# Altium schematic sheet control_system.SchDoc: Control System
size A4; Author: AJ; DrawnBy: AJ; Engineer: AJ; DocumentNumber: 1; Revision: 001; SheetNumber: 1; SheetTotal: 6; Description: Document Map
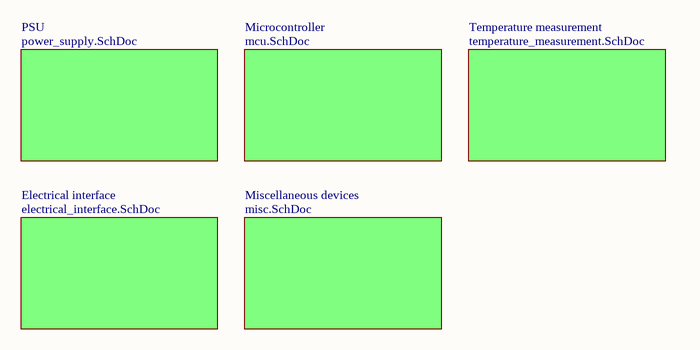
[diagram p0: control_system.SchDoc]

## Sub-sheets
Electrical interface = electrical_interface.SchDoc: no entries
Microcontroller = mcu.SchDoc: no entries
Miscellaneous devices = misc.SchDoc: no entries
PSU = power_supply.SchDoc: no entries
Temperature measurement = temperature_measurement.SchDoc: no entries

## Notes on the sheet
- TITLE
- DESCRIPTION
- SHEET
- of
- ENGINEER
- DATE
- REVISION
- AUTHOR
- FILE